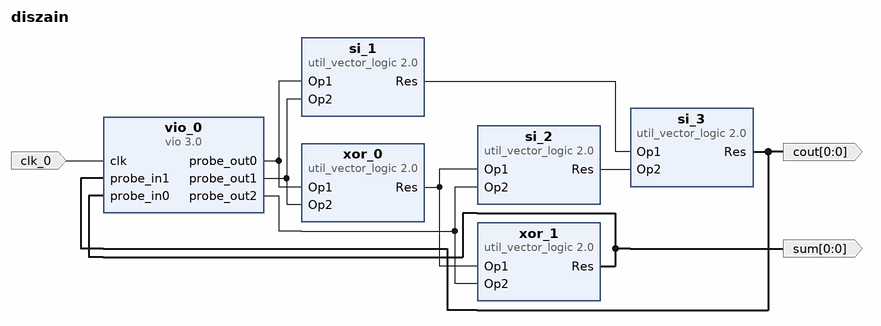
[diagram p0: block diagram of the top level]
# Vivado block design diszain, xc7a100tcsg324-1, Vivado 2019.2.1
create_bd_design diszain

create_bd_port -dir O -from 0 -to 0 sum
create_bd_port -dir O -from 0 -to 0 cout
create_bd_port -dir I -type clk clk_0

create_bd_cell -type ip -vlnv xilinx.com:ip:util_vector_logic:2.0 xor_0
set_property -dict {CONFIG.C_OPERATION xor CONFIG.C_SIZE 1} [get_bd_cells xor_0]
create_bd_cell -type ip -vlnv xilinx.com:ip:util_vector_logic:2.0 si_1
set_property -dict {CONFIG.C_SIZE 1} [get_bd_cells si_1]
create_bd_cell -type ip -vlnv xilinx.com:ip:util_vector_logic:2.0 xor_1
set_property -dict {CONFIG.C_OPERATION xor CONFIG.C_SIZE 1} [get_bd_cells xor_1]
create_bd_cell -type ip -vlnv xilinx.com:ip:util_vector_logic:2.0 si_2
set_property -dict {CONFIG.C_SIZE 1} [get_bd_cells si_2]
create_bd_cell -type ip -vlnv xilinx.com:ip:util_vector_logic:2.0 si_3
set_property -dict {CONFIG.C_OPERATION or CONFIG.C_SIZE 1} [get_bd_cells si_3]
create_bd_cell -type ip -vlnv xilinx.com:ip:vio:3.0 vio_0
set_property -dict {CONFIG.C_NUM_PROBE_IN 2 CONFIG.C_NUM_PROBE_OUT 3} [get_bd_cells vio_0]

# ---- connections ----

connect_bd_net [get_bd_pins xor_0/Res] [get_bd_pins xor_1/Op1] [get_bd_pins si_2/Op1]
connect_bd_net [get_bd_pins si_3/Res] [get_bd_ports cout] [get_bd_pins vio_0/probe_in1]
connect_bd_net [get_bd_pins si_2/Res] [get_bd_pins si_3/Op2]
connect_bd_net [get_bd_pins si_1/Res] [get_bd_pins si_3/Op1]
connect_bd_net -net Op1_0_1 [get_bd_pins vio_0/probe_out0] [get_bd_pins xor_0/Op1] [get_bd_pins si_1/Op1]
connect_bd_net -net Op2_0_1 [get_bd_pins vio_0/probe_out1] [get_bd_pins xor_0/Op2] [get_bd_pins si_1/Op2]
connect_bd_net -net Op2_1_1 [get_bd_pins vio_0/probe_out2] [get_bd_pins si_2/Op2] [get_bd_pins xor_1/Op2]
connect_bd_net [get_bd_pins xor_1/Res] [get_bd_ports sum] [get_bd_pins vio_0/probe_in0]
connect_bd_net -net clk_0_1 [get_bd_ports clk_0] [get_bd_pins vio_0/clk]

validate_bd_design
save_bd_design
